# Altium schematic sheet DIS_SENSOR.SchDoc
size A; SheetNumber: 4; SheetTotal: 7
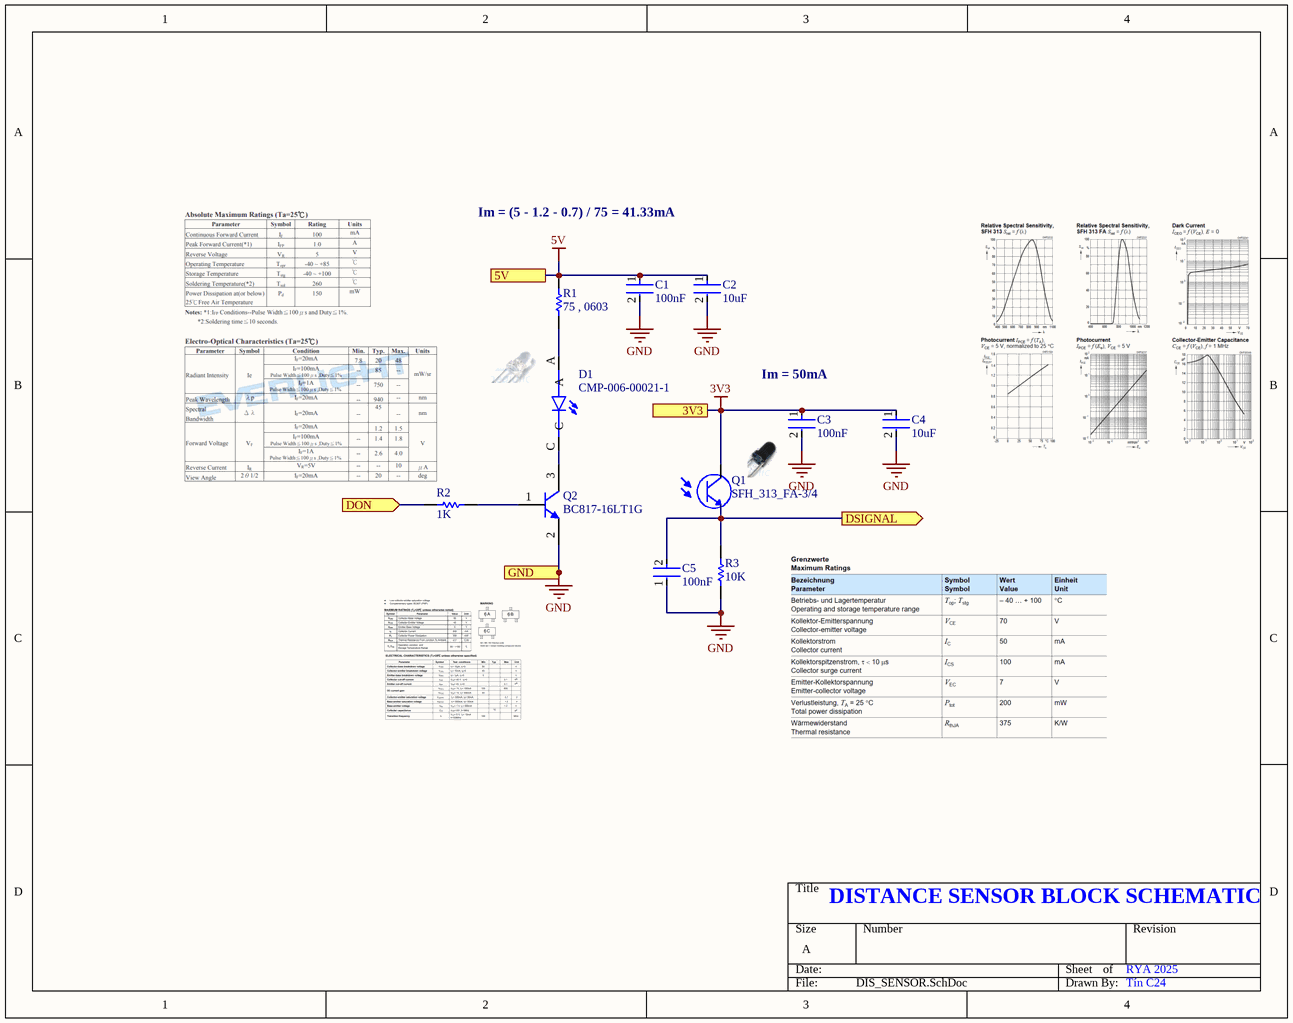
[diagram p0: DIS_SENSOR.SchDoc]

## Parts
C1  100nF  [FP-C0603C-CF-MFG]
C2  10uF  [FP-C0603C-CF-MFG]
C3  100nF  [FP-C0603C-CF-MFG]
C4  10uF  [FP-C0603C-CF-MFG]
C5  100nF  [FP-GRM15-MFG]
D1  CMP-006-00021-1  [LED_WP7113SRC/DU]
Q1  SFH_313_FA-3/4  [XDCR_SFH_313_FA-3/4]
Q2  BC817-16LT1G  [ONSC-SOT-23-3-318-08_V]
R1  75 , 0603  [RESC1608X55X25LL10T15]
R2  1K  [RESC1005X40X25LL05T05]
R3  10K  [RESC1005X40X25LL05T05]

## Ports
3V3 (see MAIN_SENSOR[4B]), 5V (see MAIN_SENSOR[4B], LINE_SENSOR[2B]), DON (in, see MAIN_SENSOR[3B]), DSIGNAL (out, see MAIN_SENSOR[3B]), GND (see MAIN_SENSOR[4B])

## Nets
3V3: C3.1 C4.1 Q1.2(C) ; port 3V3
5V: C1.1 C2.1 R1.2 ; port 5V
GND: C1.2 C2.2 C3.2 C4.2 C5.1 Q2.2(E) R3.2 ; port GND
DON: R2.2 ; port DON
DSIGNAL: C5.2 Q1.1(E) R3.1 ; port DSIGNAL
NetD1_A: D1.A R1.1
NetD1_C: D1.C Q2.3(C)
NetQ2_1: Q2.1(B) R2.1

## Notes on the sheet
- Im = (5 - 1.2 - 0.7) / 75 = 41.33mA
- (near C3) Im = 50mA
- DISTANCE SENSOR BLOCK SCHEMATIC
- RYA 2025
- Tín C24

## Library data of the parts
C1-C4 = CMP-1035-00783-3: CAP CER 20PF 50V 5% NP0 0603; Manufacturer Part Number: C0603C200J5GACTU; Manufacturer: KEMET; Temperature Coefficient: 30ppm/°C; Temperature Characteristic: C0G; Automotive Grade: Grade 1; Tolerance: 0.05; Material: Ceramic; Category: Cap; Temperature Range Low: -55°C; RoHS: TRUE; ComponentLink2URL: https://api.kemet.com/component-edge/download/datasheet/C0603C100J5GACAUTO.pdf; Package: C0603C-CF; Height: 0.87mm; Capacitance: 20 pF; Voltage Rating: 50 V; Octopart: https://octopart.com/c0603c200j5gactu-kemet-9138585; Device Class L1: Passive Components; Automotive: Yes; Digikey Description: CAP CER 20PF 50V 5% NP0 0603; Temperature Range High: +125°C; Device Class L3: Ceramic Capacitors; Mouser Description: Multilayer Ceramic Capacitors MLCC - SMD/SMT 50volts 20pF C0G 5%; ComponentLink2Description: Datasheet; Device Class L2: Capacitors; Lead Free: Yes; Temperature: -55°C to +125°C; Value: 20 pF
C5 = CMP-2100-03641-2: CAP CER 0.1UF 16V X7R 0402; Manufacturer Part Number: GRM155R71C104KA88D; Manufacturer: Murata; Standoff Height: 0mm; Tolerance: 10%; Voltage Rating: 16Vdc; Material: Ceramic; Capacitance: 0.10μF; Value: 0.10μF; RoHS: TRUE; Temperature Characteristic: X7R; Octopart: https://octopart.com/grm155r71c104ka88d-murata-196880; Digikey Description: CAP CER 0.1UF 16V X7R 0402; Device Class L3: Ceramic Capacitors; Height: 0.55mm; ComponentLink2Description: Datasheet; Temperature Range Low: -55°C; Ipc Land Pattern Name: CAPC10050X219; ComponentLink2URL: https://search.murata.co.jp/Ceramy/image/img/A01X/G101/ENG/GRM155R71H471KA01-01A.pdf; Device Class L1: Passive Components; Lead Free: yes; Category: Cap; Package: GRM15; Temperature: -55°C to +125°C; Device Class L2: Capacitors; Temperature Range High: +125°C; Mouser Description: 0402 0.1 uF 16V ±10 % Tolerance X7R SMT Multilayer Ceramic Capacitor
D1 = CMP-006-00021-1: Red 640nm LED Indication - Discrete 1.85V Radial; Value: 10pH; MF: Kingbright; MP: WP7113SRC/DU; SnapEDA_Link: https://www.snapeda.com/parts/WP7113SRC/DU/Kingbright/view-part/826988/?ref=snap; Price: 1000VND; Availability: Unavailable; Case/Package: Radial Kingbright; Design Item ID: WP7113SRC/DU; Source: SnapEDAsch.SchLib; Pins: 2; Component Type: Standard
Q1 = SFH_313_FA-3/4: Phototransistors 870nm Top View Radial - 2 Leads; MF: OSRAM Opto; MP: SFH 313 FA-3/4; Package: Radial-2 Osram Opto; Value: *; Check_prices: https://www.snapeda.com/parts/SFH%20313%20FA-3/4/OSRAM%20Opto%20Semiconductors%20Inc./view-part/240737/?ref=eda; Digi-Key_Part_Number: 475-3328-ND; SnapEDA_Link: https://www.snapeda.com/parts/SFH%20313%20FA-3/4/OSRAM%20Opto%20Semiconductors%20Inc./view-part/240737/?ref=snap
Q2 = CMP-1048-00736-1: General Purpose Transistor, NPN Silicon, 3-Pin SOT-23, Pb-Free, Tape and Reel; Manufacturer: On Semiconductor; IC Continuous (A): 0.5; fT Min (MHz): 100; PartNumber: BC817-16LT1G; Mounting Technology: Surface Mount; PackageVersion: Rev. AP, 11/2009; ComponentLink3Description: Package Specification; PackageReference: SOT-23-3-318-08; Packing: Tape and Reel; ComponentLink1URL: http://www.onsemi.com/; Polarity: NPN; RoHS: TRUE; ComponentLink2URL: http://www.onsemi.com/pub_link/Collateral/BC817-16LT1-D.PDF; ComponentLink3URL: http://www.onsemi.cn/pub_link/Collateral/318-08.PDF; ComponentLink2Description: Datasheet; PackageDescription: 3-Pin Small Outline Transistor, Body 2.92 x 1.3 mm, Pitch 0.95 mm; ComponentLink1Description: Manufacturer URL; DatasheetVersion: Rev. 12
R1 = CMP-2000-06934-1: Thick Film Resistor, 2.2 KOhm, 100 mW, 50 V, +/- 1%, -55 to 155 degC, 2-Pin SMD (0603), RoHS, Tape and Reel; Manufacturer: Yageo; Resistance: 2.2kOhms; Temperature Coefficient: 100PPM/C; Voltage Rating: 50V; Power Rating: 100mW; Tolerance: 1%; Datasheet Version: Rev. 7, 05/2017; Case Code - mm: 1608; Series: RC; Mounting Technology: SurfaceMount; Package Description: 2-Pin Surface Mount Device, Body 1.6 x 0.8 mm; Case Code - in: 0603; Package Reference: 0603; Product: ThickFilmResistorsGeneralPurpose; Manufacturer URL: http://www.yageo.com/; Termination Style: SMD/SMT; Operating Temperature Range: -55Cto+155C; Datasheet URL: http://www.yageo.com/documents/recent/PYu-RC_Group_51_RoHS_L_7.pdf; Packaging: Reel
R2 = CMP-2000-07451-1: 0402 , 1KOhm; Manufacturer: Panasonic; Voltage Rating (DC): 50V; Temperature Coefficient: 600ppm/��C; Max Power Dissipation: 100mW; Resistance: 0mOhm; Tolerance: 5%; Number of Terminations: 2; Mount: SurfaceMount; Height: 0.35mm; Packaging: TapeandReel; Contact Plating: Tin; Manufacturer URL: http://www.panasonic.com/; Composition: ThickFilm; Max Operating Temperature: 155degC; REACH SVHC: NoSVHC; Case/Package: 0402; Package Reference: 402; Depth: 0.5mm; Package Description: 2-Pin Surface Mount Device, Body 1 x 0.5 mm; Datasheet URL: https://industrial.panasonic.com/cdbs/www-data/pdf/RDA0000/AOA0000C301.pdf; RoHSCompliant: True; Case Code (Imperial): 0402; Military Standard: Not; Min Operating Temperature: -55degC; Power Rating: 100mW; Datasheet Version: 03/2015; Length: 1mm; Case Code (Metric): 1005; Termination: SMD/SMT; Mounting Technology: SurfaceMount; Voltage Rating: 50V; Width: 0.02inch; Package Quantity: 1; Lead Free: LeadFree; Radiation Hardening: No
R3 = CMP-2000-07451-1: Chip Resistor, 0 Ohm, 0.1 W, -55 to 155 degC, 0402 (1005 Metric), RoHS, Tape and Reel; Manufacturer: Panasonic; Voltage Rating (DC): 50V; Temperature Coefficient: 600ppm/��C; Max Power Dissipation: 100mW; Resistance: 0mOhm; Tolerance: 5%; Number of Terminations: 2; Mount: SurfaceMount; Height: 0.35mm; Packaging: TapeandReel; Contact Plating: Tin; Manufacturer URL: http://www.panasonic.com/; Composition: ThickFilm; Max Operating Temperature: 155degC; REACH SVHC: NoSVHC; Case/Package: 0402; Package Reference: 402; Depth: 0.5mm; Package Description: 2-Pin Surface Mount Device, Body 1 x 0.5 mm; Datasheet URL: https://industrial.panasonic.com/cdbs/www-data/pdf/RDA0000/AOA0000C301.pdf; RoHSCompliant: True; Case Code (Imperial): 0402; Military Standard: Not; Min Operating Temperature: -55degC; Power Rating: 100mW; Datasheet Version: 03/2015; Length: 1mm; Case Code (Metric): 1005; Termination: SMD/SMT; Mounting Technology: SurfaceMount; Voltage Rating: 50V; Width: 0.02inch; Package Quantity: 1; Lead Free: LeadFree; Radiation Hardening: No